# Altium schematic sheet FPGA_B.SchDoc: POLYSOME CRYPTO 01
size A3; Revision: V1; SheetNumber: 3; SheetTotal: 8; ProjectName: POLYSOME CRYPTO 01
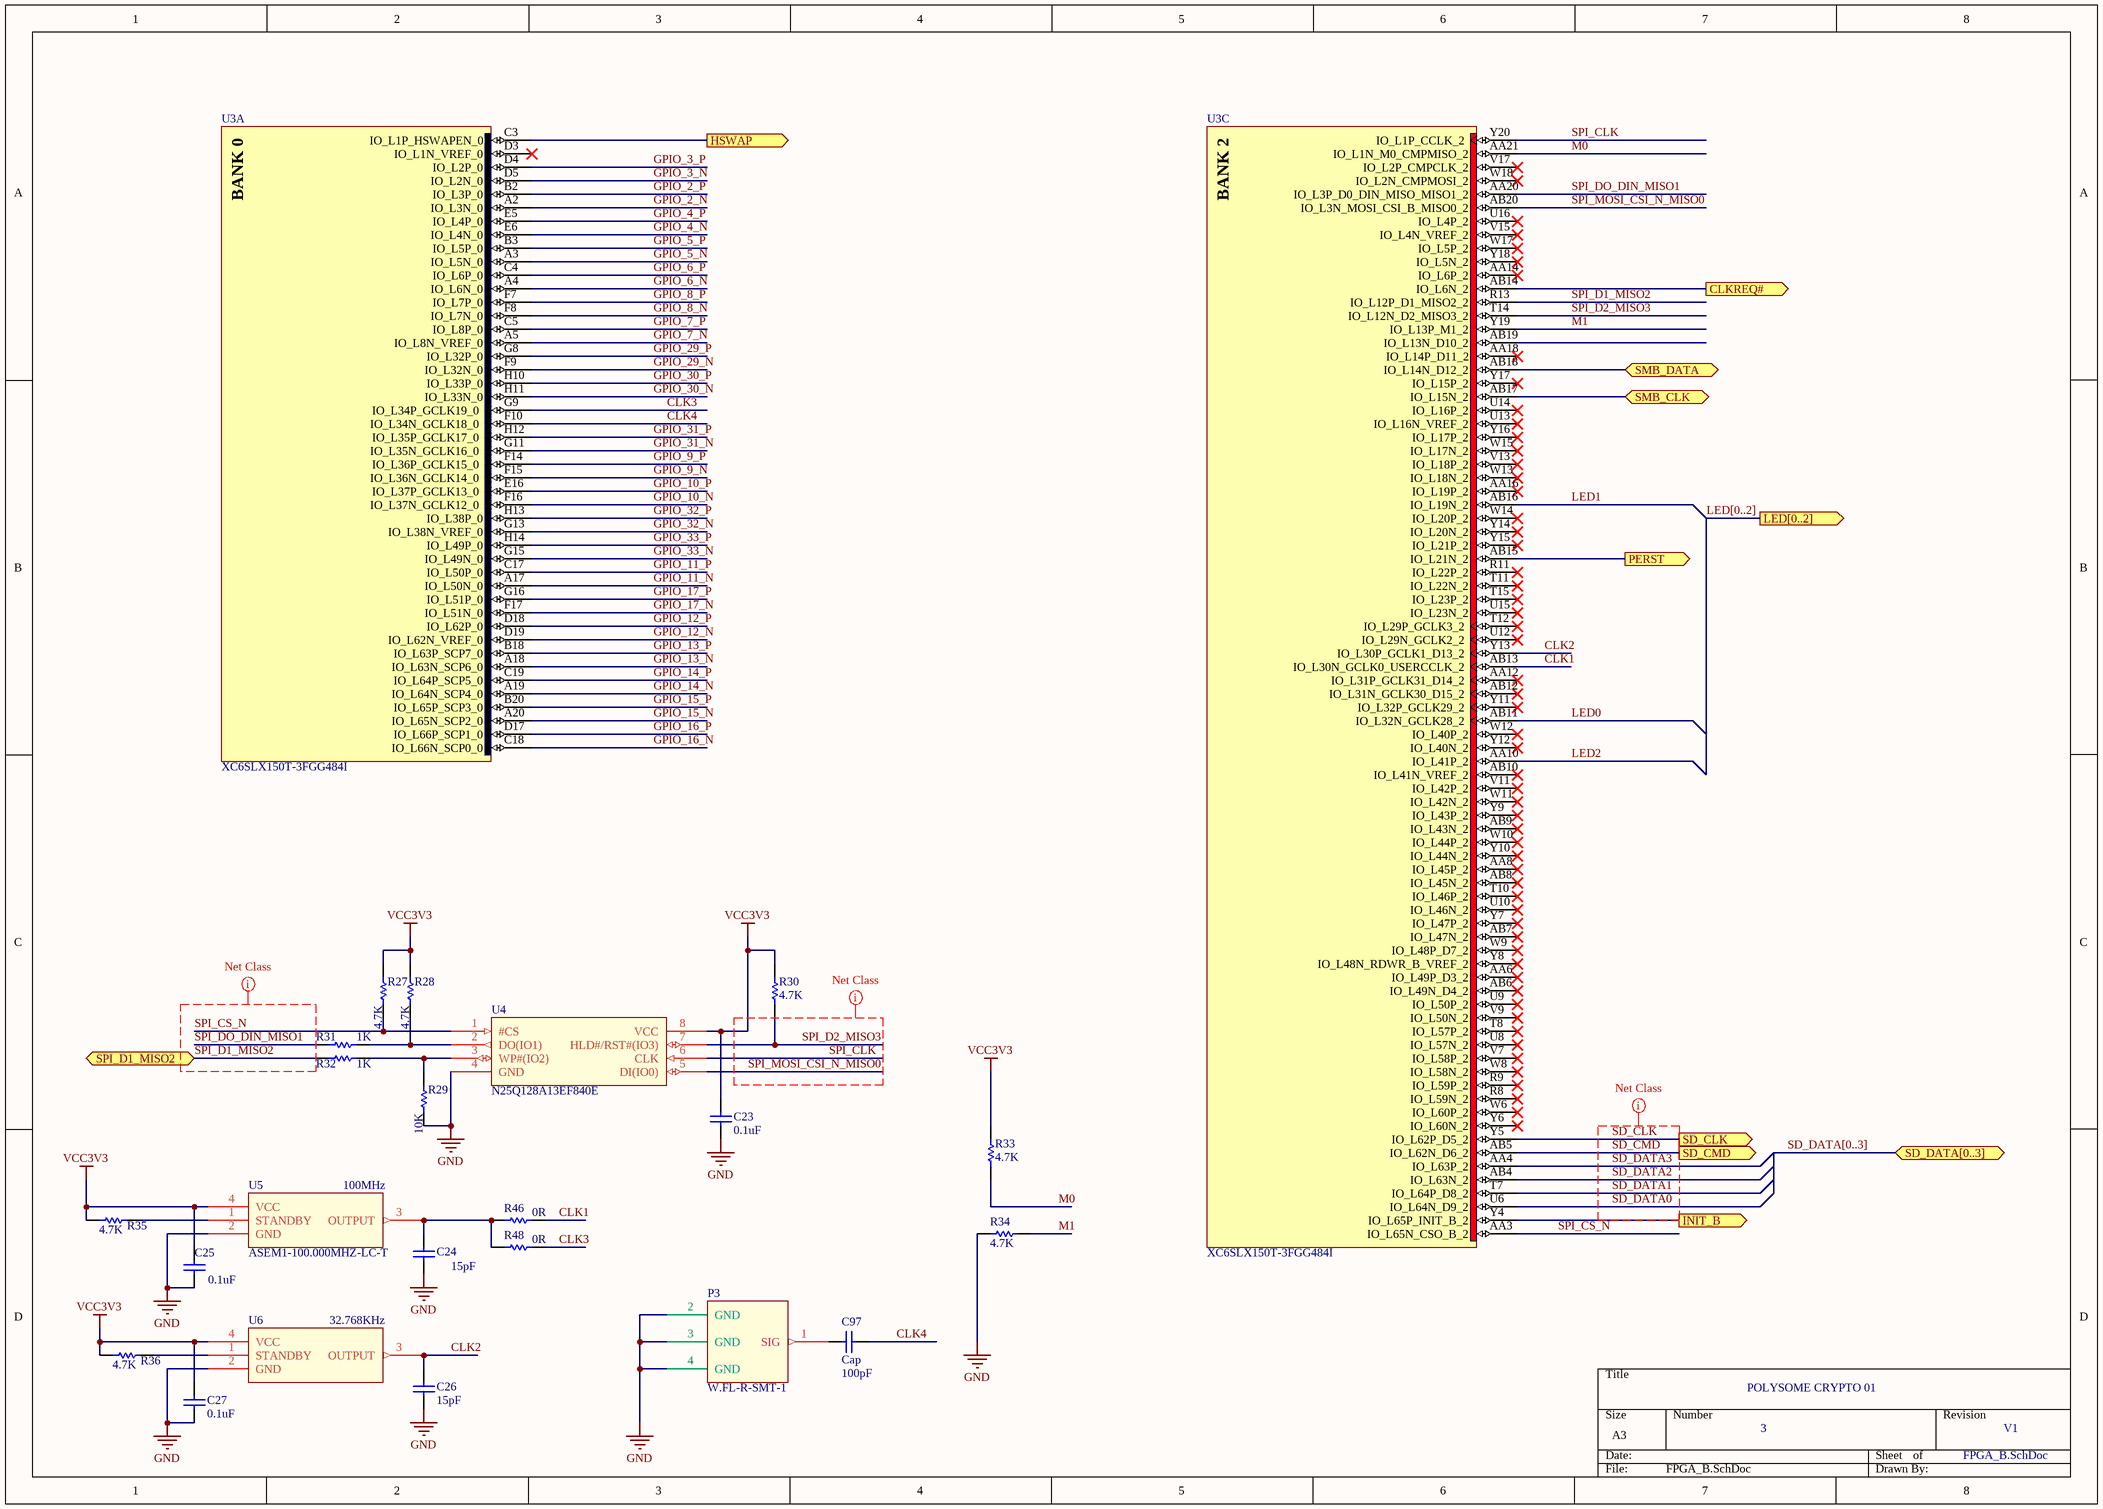
[diagram p0: FPGA_B.SchDoc]

## Parts
C23  value 0.1uF  [0402]  (hidden comment: Cap Semi)
C24  value 15pF  [0402]  (hidden comment: Cap Semi)
C25  value 0.1uF  [0402]  (hidden comment: Cap Semi)
C26  value 15pF  [0402]  (hidden comment: Cap Semi)
C27  value 0.1uF  [0402]  (hidden comment: Cap Semi)
C97  Cap  value 100pF  [0402]
P3  W.FL-R-SMT-1  [W.FL-R-SMT-1]
R27  value 4.7K  [0402]  (hidden comment: Res Semi)
R28  value 4.7K  [0402]  (hidden comment: Res Semi)
R29  value 10K  [0402]  (hidden comment: Res Semi)
R30  value 4.7K  [0402]  (hidden comment: Res Semi)
R31  value 1K  [0402]  (hidden comment: Res Semi)
R32  value 1K  [0402]  (hidden comment: Res Semi)
R33  value 4.7K  [0402]  (hidden comment: Res Semi)
R34  value 4.7K  [0402]  (hidden comment: Res Semi)
R35  value 4.7K  [0402]  (hidden comment: Res Semi)
R36  value 4.7K  [0402]  (hidden comment: Res Semi)
R46  value 0R  [0402]  (hidden comment: Res Semi)
R48  value 0R  [0402]  (hidden comment: Res Semi)
U3  XC6SLX150T-3FGG484I  [FGG484]  (parts A,C of 8)
U4  N25Q128A13EF840E  [8S2_L]
U5  ASEM1-100.000MHZ-LC-T  [DFN170P200X100-4N]
U6  ASEM1-LC-T  (value not drawn)

## Ports
CLKREQ# (out), HSWAP (out), INIT_B (out), LED[0..2] (out), PERST (out), SD_CLK (out), SD_CMD (out), SD_DATA[0..3] (bidir), SMB_CLK (bidir), SMB_DATA (bidir), SPI_D1_MISO2

## Nets
GND: C23.1 C24.1 C25.2 C26.2 C27.2 P3.2(GND) P3.3(GND) P3.4(GND) R29.1 R34.2 U4.4(GND) U5.2(GND) U6.2(GND)
VCC3V3: C23.2 C25.1 C27.1 R27.2 R28.2 R30.2 R33.2 R35.1 R36.1 U4.8(VCC) U5.4(VCC) U6.4(VCC)
CLK1: R46.2 U3.AB13(IO_L30N_GCLK0_USERCCLK_2)
CLK2: C26.1 U3.Y13(IO_L30P_GCLK1_D13_2) U6.3(OUTPUT)
CLK3: R48.2 U3.G9(IO_L34P_GCLK19_0)
CLK4: C97.2 U3.F10(IO_L34N_GCLK18_0)
CLKREQ#: U3.AB14(IO_L6N_2) ; port CLKREQ#
GPIO_2_N: U3.A2(IO_L3N_0)
GPIO_2_P: U3.B2(IO_L3P_0)
GPIO_3_N: U3.D5(IO_L2N_0)
GPIO_3_P: U3.D4(IO_L2P_0)
GPIO_4_N: U3.E6(IO_L4N_0)
GPIO_4_P: U3.E5(IO_L4P_0)
GPIO_5_N: U3.A3(IO_L5N_0)
GPIO_5_P: U3.B3(IO_L5P_0)
GPIO_6_N: U3.A4(IO_L6N_0)
GPIO_6_P: U3.C4(IO_L6P_0)
GPIO_7_N: U3.A5(IO_L8N_VREF_0)
GPIO_7_P: U3.C5(IO_L8P_0)
GPIO_8_N: U3.F8(IO_L7N_0)
GPIO_8_P: U3.F7(IO_L7P_0)
GPIO_9_N: U3.F15(IO_L36N_GCLK14_0)
GPIO_9_P: U3.F14(IO_L36P_GCLK15_0)
GPIO_10_N: U3.F16(IO_L37N_GCLK12_0)
GPIO_10_P: U3.E16(IO_L37P_GCLK13_0)
GPIO_11_N: U3.A17(IO_L50N_0)
GPIO_11_P: U3.C17(IO_L50P_0)
GPIO_12_N: U3.D19(IO_L62N_VREF_0)
GPIO_12_P: U3.D18(IO_L62P_0)
GPIO_13_N: U3.A18(IO_L63N_SCP6_0)
GPIO_13_P: U3.B18(IO_L63P_SCP7_0)
GPIO_14_N: U3.A19(IO_L64N_SCP4_0)
GPIO_14_P: U3.C19(IO_L64P_SCP5_0)
GPIO_15_N: U3.A20(IO_L65N_SCP2_0)
GPIO_15_P: U3.B20(IO_L65P_SCP3_0)
GPIO_16_N: U3.C18(IO_L66N_SCP0_0)
GPIO_16_P: U3.D17(IO_L66P_SCP1_0)
GPIO_17_N: U3.F17(IO_L51N_0)
GPIO_17_P: U3.G16(IO_L51P_0)
GPIO_29_N: U3.F9(IO_L32N_0)
GPIO_29_P: U3.G8(IO_L32P_0)
GPIO_30_N: U3.H11(IO_L33N_0)
GPIO_30_P: U3.H10(IO_L33P_0)
GPIO_31_N: U3.G11(IO_L35N_GCLK16_0)
GPIO_31_P: U3.H12(IO_L35P_GCLK17_0)
GPIO_32_N: U3.G13(IO_L38N_VREF_0)
GPIO_32_P: U3.H13(IO_L38P_0)
GPIO_33_N: U3.G15(IO_L49N_0)
GPIO_33_P: U3.H14(IO_L49P_0)
HSWAP: U3.C3(IO_L1P_HSWAPEN_0) ; port HSWAP
INIT_B: U3.Y4(IO_L65P_INIT_B_2) ; port INIT_B
LED0: U3.AB11(IO_L32N_GCLK28_2)
LED1: U3.AB16(IO_L19N_2)
LED2: U3.AA10(IO_L41P_2)
M0: R33.1 U3.AA21(IO_L1N_M0_CMPMISO_2)
M1: R34.1 U3.Y19(IO_L13P_M1_2)
PERST: U3.AB15(IO_L21N_2) ; port PERST
SD_CLK: U3.Y5(IO_L62P_D5_2) ; port SD_CLK
SD_CMD: U3.AB5(IO_L62N_D6_2) ; port SD_CMD
SD_DATA0: U3.U6(IO_L64N_D9_2)
SD_DATA1: U3.T7(IO_L64P_D8_2)
SD_DATA2: U3.AB4(IO_L63N_2)
SD_DATA3: U3.AA4(IO_L63P_2)
SMB_CLK: U3.AB17(IO_L15N_2) ; port SMB_CLK
SMB_DATA: U3.AB18(IO_L14N_D12_2) ; port SMB_DATA
SPI_CLK: U3.Y20(IO_L1P_CCLK_2) U4.6(CLK)
SPI_CS_N: R27.1 U3.AA3(IO_L65N_CSO_B_2) U4.1(#CS)
SPI_D1_MISO2: R32.1 U3.R13(IO_L12P_D1_MISO2_2) ; port SPI_D1_MISO2
SPI_D2_MISO3: R30.1 U3.T14(IO_L12N_D2_MISO3_2) U4.7(HLD#/RST#(IO3))
SPI_DO_DIN_MISO1: R31.1 U3.AA20(IO_L3P_D0_DIN_MISO_MISO1_2)
SPI_MOSI_CSI_N_MISO0: U3.AB20(IO_L3N_MOSI_CSI_B_MISO0_2) U4.5(DI(IO0))
NetC24_2: C24.2 R46.1 R48.1 U5.3(OUTPUT)
NetC97_1: C97.1 P3.1(SIG)
NetR28_1: R28.1 R31.2 U4.2(DO(IO1))
NetR29_2: R29.2 R32.2 U4.3(WP#(IO2))
NetR35_2: R35.2 U5.1(STANDBY)
NetR36_2: R36.2 U6.1(STANDBY)

Not connected (* = marked no-connect by the designer): U3 AA6(IO_L49P_D3_2)* AA8(IO_L45P_2)* AA12(IO_L31P_GCLK31_D14_2)* AA14(IO_L6P_2)* AA16(IO_L19P_2)* AA18(IO_L14P_D11_2)* AB6(IO_L49N_D4_2)* AB7(IO_L47N_2)* AB8(IO_L45N_2)* AB9(IO_L43N_2)* AB10(IO_L41N_VREF_2)* AB12(IO_L31N_GCLK30_D15_2)* AB19(IO_L13N_D10_2) D3(IO_L1N_VREF_0)* R8(IO_L59N_2)* R9(IO_L59P_2)* R11(IO_L22P_2)* T8(IO_L57P_2)* T10(IO_L46P_2)* T11(IO_L22N_2)* T12(IO_L29P_GCLK3_2)* T15(IO_L23P_2)* U8(IO_L57N_2)* U9(IO_L50P_2)* U10(IO_L46N_2)* U12(IO_L29N_GCLK2_2)* U13(IO_L16N_VREF_2)* U14(IO_L16P_2)* U15(IO_L23N_2)* U16(IO_L4P_2)* V7(IO_L58P_2)* V9(IO_L50N_2)* V11(IO_L42P_2)* V13(IO_L18P_2)* V15(IO_L4N_VREF_2)* V17(IO_L2P_CMPCLK_2)* W6(IO_L60P_2)* W8(IO_L58N_2)* W9(IO_L48P_D7_2)* W10(IO_L44P_2)* W11(IO_L42N_2)* W12(IO_L40P_2)* W13(IO_L18N_2)* W14(IO_L20P_2)* W15(IO_L17N_2)* W17(IO_L5P_2)* W18(IO_L2N_CMPMOSI_2)* Y6(IO_L60N_2)* Y7(IO_L47P_2)* Y8(IO_L48N_RDWR_B_VREF_2)* Y9(IO_L43P_2)* Y10(IO_L44N_2)* Y11(IO_L32P_GCLK29_2)* Y12(IO_L40N_2)* Y14(IO_L20N_2)* Y15(IO_L21P_2)* Y16(IO_L17P_2)* Y17(IO_L15P_2)* Y18(IO_L5N_2)*

## Buses and harness runs
bus LED[0..2] = port LED[0..2]
bus SD_DATA[0..3] = port SD_DATA[0..3]

## Layout directives
net class SPI: SPI_CLK, SPI_CS_N, SPI_D1_MISO2, SPI_D2_MISO3, SPI_DO_DIN_MISO1, SPI_MOSI_CSI_N_MISO0
net class SD: SD_CLK, SD_CMD, SD_DATA0, SD_DATA1, SD_DATA2, SD_DATA3

## Notes on the sheet
- (near U5) 100MHz
- (near U6) 32.768KHz
- POLYSOME CRYPTO 01
- (in symbol XC6SLX150T-3FGG484I, part A) BANK 0
- (in symbol XC6SLX150T-3FGG484I, part C) BANK 2

## Library data of the parts
C23-C27 = Cap Semi: Capacitor (Semiconductor SIM Model); Published: 8-Jun-2000; LatestRevisionDate: 29-May-2009; LatestRevisionNote: IPC-7351 Footprint Added.; PackageReference: C1206; Publisher: Altium Limited; PackageDescription: Chip Capacitor
C97 = Cap: Capacitor; Published: 8-Jun-2000; LatestRevisionDate: 17-Jul-2002; LatestRevisionNote: Re-released for DXP Platform.; PackageReference: RAD-0.3; Publisher: Altium Limited; PackageDescription: Radial Cap, Thru-Hole; 2 Leads; 0.3 in Pin Spacing
R27-R36 R46 R48 = Res Semi: Semiconductor Resistor; Published: 8-Jun-2000; LatestRevisionDate: 17-Jul-2002; LatestRevisionNote: Re-released for DXP Platform.; PackageReference: AXIAL-0.5; Publisher: Altium Limited; PackageDescription: Axial Device, Thru-Hole; 2 Leads; 0.5 in Pin Spacing
U3 = XC6SLX150T-3FGG484I: Spartan-6 LXT 1.2V FPGA, 296 User I/Os, 484-Ball Fine-Pitch BGA (1.0mm Pitch), Speed Grade 3, Industrial Grade, Pb-Free; Published: 17-Nov-2009; DatasheetVersion: ver1.6, Nov-2010; PackageVersion: ver1.1, Dec-2008; PackageReference: FGG484; Publisher: Altium Limited; PackageDescription: 484-Ball Fine Pitch Ball Grid Array 1.00 mm Pitch (FGG484) - Pb-Free; Supplier 1: Digi-Key; Supplier Part Number 1: XC6SLX150T-3FGG484I-ND; Code_JEDEC: MS-034-AAJ-1; Code_IPC: BGA100P22X22-484; ComponentLink1Description: Manufacturer Link; ComponentLink1URL: http://www.xilinx.com; ComponentLink2Description: Spartan-6 Datasheet; ComponentLink2URL: http://www.xilinx.com/support/documentation/data_sheets/ds160.pdf; ComponentLink3Description: Spartan-6 Documents; ComponentLink3URL: http://www.xilinx.com/support/documentation/spartan-6.htm; ComponentLink4Description: Xilinx.com Home; ComponentLink4URL: http://www.xilinx.com
U4 = N25Q128A13EF840E: IC FLASH 128MBIT 108MHZ 8VDFN; Manufacturer: Micron Technology Inc; Memory Type: FLASH - NOR; Memory Size: 128M (32Mx4); Interface: SPI Serial; Voltage - Supply: 2.7 V ~ 3.6 V; Supplier 1: Digi-Key; Manufacturer Part Number: N25Q128A13EF840E; RoHS: RoHS Compliant; Category: Integrated Circuits (ICs); Stock 1: 2864; Pricing 1: 1=1.88, 10=1.713, 50=1.6588, 100=1.4828, 250=1.4784, 500=1.4564, 1000=1.39392, 2500=1.34288, 5000=1.298 (USD); Packaging: Tray; Format - Memory: FLASH; Speed: 108MHz; Operating Temperature: -40°C ~ 85°C; Package / Case: 8-VDFN Exposed Pad; Supplier Device Package: 8-VDFPN (MLP8) (8x6); ComponentLink1URL: http://www.micron.com/~/media/Documents/Products/Data%20Sheet/NOR%20Flash/Serial%20NOR/N25Q/n25q_128mb_3v_65nm.pdf; ComponentLink1Description: http://www.micron.com/~/media/Documents/Products/Data%20Sheet/NOR%20Flash/Serial%20NOR/N25Q/n25q_128mb_3v_65nm.pdf; Supplier Part Number 1: 557-1561-ND
U5 = ASEM1-100.000MHZ-LC-T: ABRACON - ASEM1-100.000MHZ-LC-T - MEMS OSC, 100MHZ, 3.2 X 2.5MM, CMOS; Product Range: ABRACON - ASEM Series; Frequency Nom: 100; Frequency Stability + / -: 50; Supply Voltage Nom: 3.3; Oscillator Case: SMD, 3.2mm x 2.5; Supplier 1: Newark; Manufacturer: ABRACON; Manufacturer Part Number: ASEM1-100.000MHZ-LC-T; RoHS: YES; Stock 1: 67; Pricing 1: 1=1.63, 10=1.56, 50=1.53, 100=1.31, 500=1.27 (USD); Oscillator Output Compatibility: CMOS; ComponentLink1URL: http://www.abracon.com/Oscillators/ASEM.pdf; ComponentLink1Description: http://www.abracon.com/Oscillators/ASEM.pdf; Supplier Part Number 1: 14N7956
U6 = ASEM1-HZ-LC-T: ABRACON - ASEM1-HZ-LC-T - MEMS OSC, 3.2 X 2.5MM, CMOS; Manufacturer Part Number: ASEM1-xxxxMHZ-LC-T; Product Range: ABRACON - ASEM Series; Frequency Nom: 100; Frequency Stability + / -: 50; Supply Voltage Nom: 3.3; Oscillator Case: SMD, 3.2mm x 2.5; Supplier 1: Newark; Manufacturer: ABRACON; RoHS: YES; Stock 1: 67; Pricing 1: 1=1.63, 10=1.56, 50=1.53, 100=1.31, 500=1.27 (USD); Oscillator Output Compatibility: CMOS; ComponentLink1URL: http://www.abracon.com/Oscillators/ASEM.pdf; ComponentLink1Description: http://www.abracon.com/Oscillators/ASEM.pdf; Supplier Part Number 1: 14N7956